# EAGLE schematic cn7macropad (EAGLE 9.6.2)

## Sheet 1 of 3
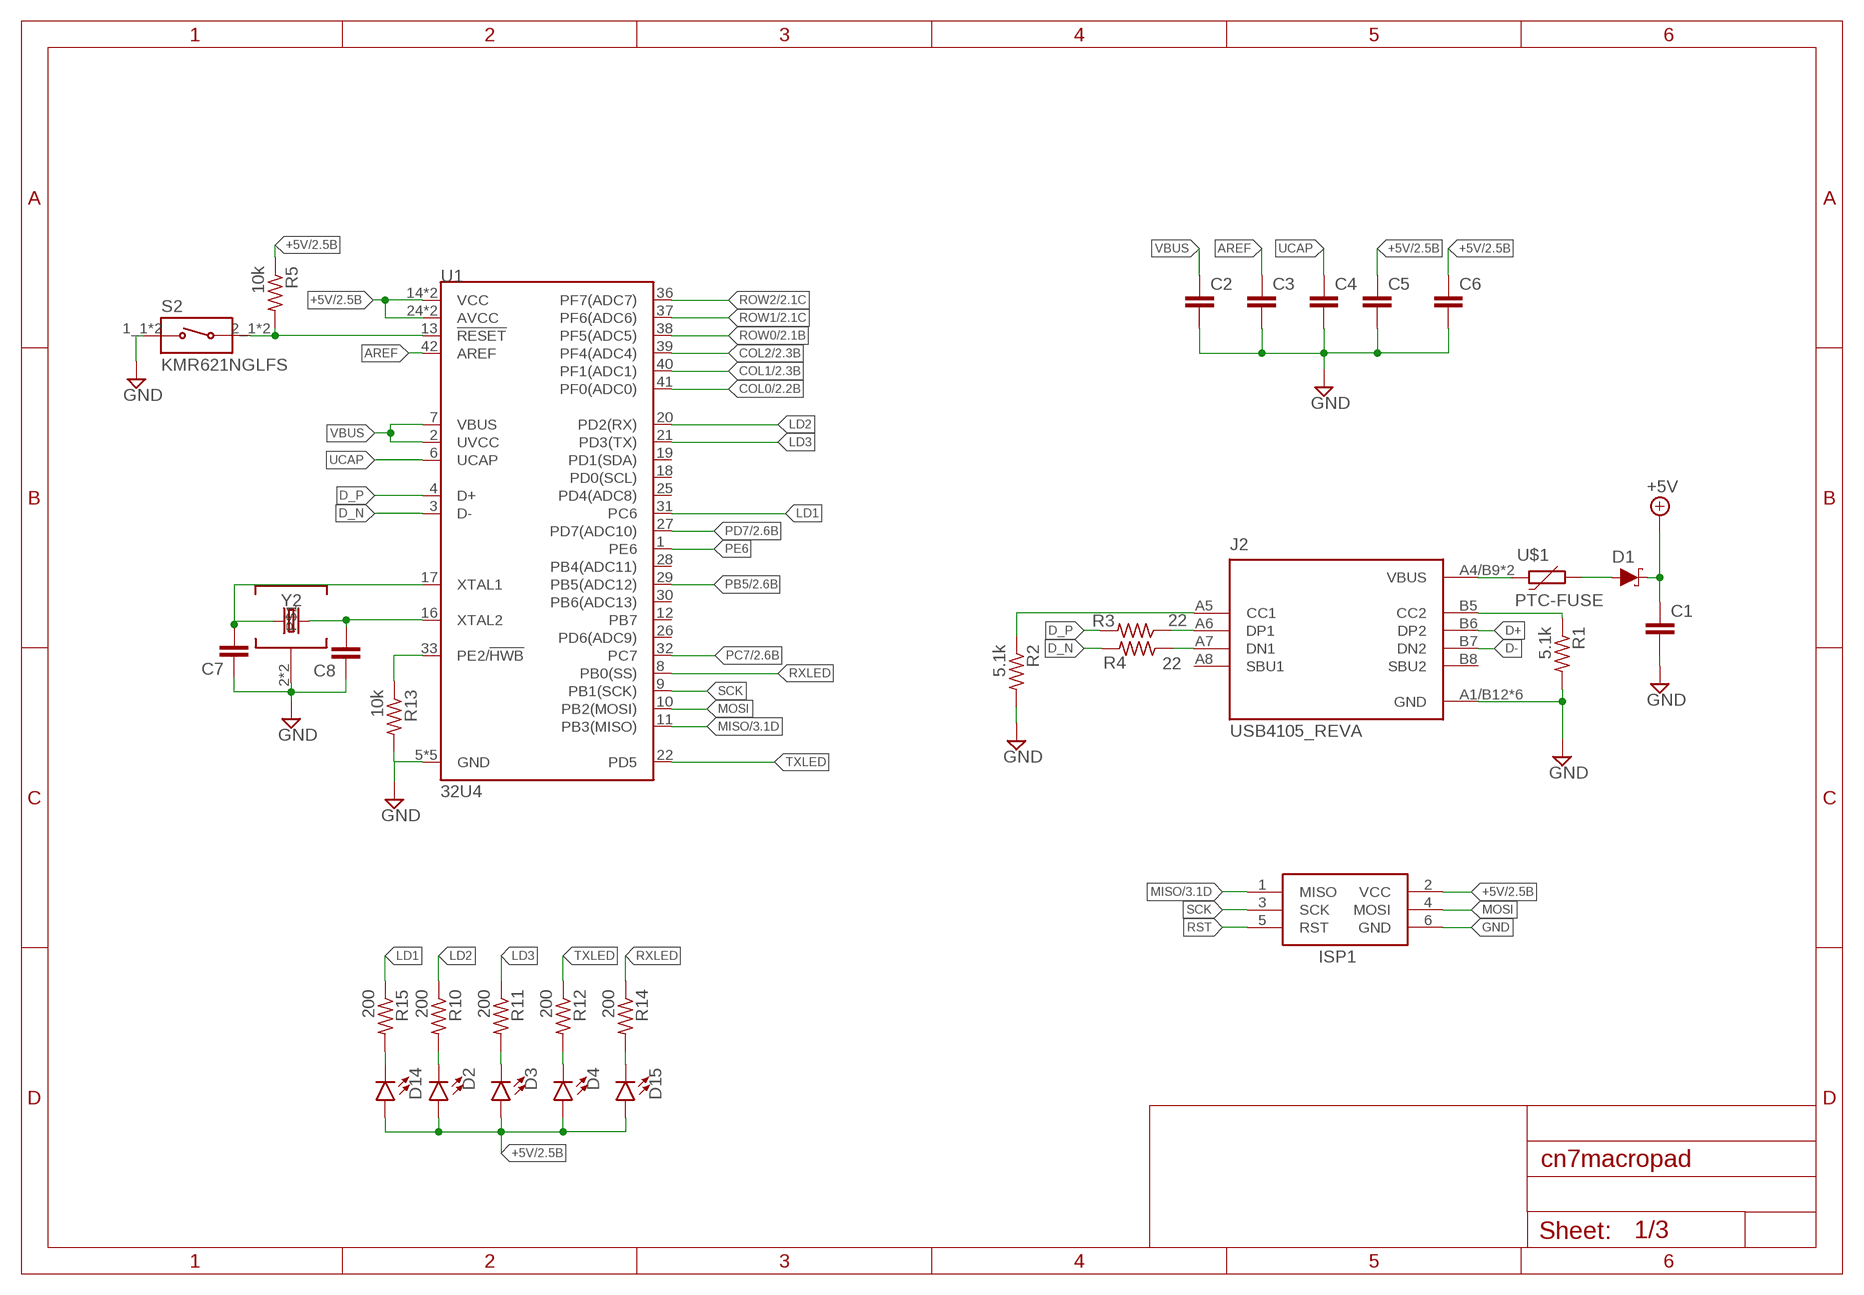
[diagram p0: schematic, sheet 1]

### Parts
C1  10uF  CAP-0603-50V-5%  [0603]
C2  1.0uF  CAP-0603-50V-5%  [0603]
C3  1.0uF  CAP-0603-50V-5%  [0603]
C4  1.0uF  CAP-0603-50V-5%  [0603]
C5  1.0uF  CAP-0603-50V-5%  [0603]
C6  1.0uF  CAP-0603-50V-5%  [0603]
C7  22pF  CAP-0603-50V-5%  [0603]
C8  22pF  CAP-0603-50V-5%  [0603]
D1  3A/10V/280mV  DIODE-SCHOTTKY-BAT60A  [SOD-323]
D2  LED0603  [LED-0603]
D3  LED0603  [LED-0603]
D4  LED0603  [LED-0603]
D14  LED0603  [LED-0603]
D15  LED0603  [LED-0603]
ISP1  AVRISP-6  [AVRISP]
J2  USB4105_REVA  [GCT_USB4105_REVA]
R1  5.1k  RESISTORR0603  [R0603]
R2  5.1k  RESISTORR0603  [R0603]
R3  22  RESISTORR0603  [R0603]
R4  22  RESISTORR0603  [R0603]
R5  10k  RESISTORR0603  [R0603]
R10  200  RESISTORR0603  [R0603]
R11  200  RESISTORR0603  [R0603]
R12  200  RESISTORR0603  [R0603]
R13  10k  RESISTORR0603  [R0603]
R14  200  RESISTORR0603  [R0603]
R15  200  RESISTORR0603  [R0603]
S2  KMR621NGLFS  [SW_KMR621NGLFS]
U1  32U4  ATMEGA32U4TQFP-44  [TQFP44]
U$1  PTC-FUSE  [PTC1206]
Y2  CRYSTALSMD-3.2X2.5  [CRYSTAL-SMD-3.2X2.5MM]

### Nets
+5V: C1.1 C5.1 C6.1 D1.C D2.A D3.A D4.A D14.A D15.A ISP1.2(VCC) R5.1 U1.14(VCC) U1.24(AVCC) U1.34(VCC) U1.44(AVCC) ; also sheet 2,3
AREF: C3.1 U1.42(AREF)
CC1: J2.A5(CC1) R2.1
CC2: J2.B5(CC2) R1.1
COL0: U1.41(PF0(ADC0)) ; also sheet 2
COL1: U1.40(PF1(ADC1)) ; also sheet 2
COL2: U1.39(PF4(ADC4)) ; also sheet 2
D+: J2.A6(DP1) J2.B6(DP2) R3.1
D-: J2.A7(DN1) J2.B7(DN2) R4.1
D_N: R4.2 U1.3(D-)
D_P: R3.2 U1.4(D+)
GND: C1.2 C2.2 C3.2 C4.2 C5.2 C6.2 C7.1 C8.1 ISP1.6(GND) J2.A1/B12(GND) J2.B1/A12(GND) J2.G1(GND) J2.G2(GND) J2.G3(GND) J2.G4(GND) R1.2 R2.2 R13.2 S2.1_1 S2.1_2 U1.5(GND) U1.15(GND) U1.23(GND) U1.35(GND) U1.43(GND) Y2.2 Y2.4 ; also sheet 2,3
LD1: R15.1 U1.31(PC6)
LD2: R10.1 U1.20(PD2(RX))
LD3: R11.1 U1.21(PD3(TX))
MISO: ISP1.1(MISO) U1.11(PB3(MISO)) ; also sheet 3
MOSI: ISP1.4(MOSI) U1.10(PB2(MOSI))
N$1: R13.1 U1.33(PE2/!HWB)
N$3: D15.C R14.2
N$5: D14.C R15.2
N$7: D1.A U$1.2
N$10: C7.2 U1.17(XTAL1) Y2.1
N$11: C8.2 U1.16(XTAL2) Y2.3
N$26: D2.C R10.2
N$27: D3.C R11.2
N$32: D4.C R12.2
PB5: U1.29(PB5(ADC12)) ; also sheet 2
PC7: U1.32(PC7) ; also sheet 2
PD7: U1.27(PD7(ADC10)) ; also sheet 2
PE6: U1.1(PE6)
ROW0: U1.38(PF5(ADC5)) ; also sheet 2
ROW1: U1.37(PF6(ADC6)) ; also sheet 2
ROW2: U1.36(PF7(ADC7)) ; also sheet 2
RST: ISP1.5(RST) R5.2 S2.2_1 S2.2_2 U1.13(!RESET)
RXLED: R14.1 U1.8(PB0(SS))
SCK: ISP1.3(SCK) U1.9(PB1(SCK))
TXLED: R12.1 U1.22(PD5)
UCAP: C4.1 U1.6(UCAP)
VBUS: C2.1 J2.A4/B9(VBUS) J2.B4/A9(VBUS) U1.2(UVCC) U1.7(VBUS) U$1.1
Unconnected: J2.A8(SBU1) J2.B8(SBU2) U1.12(PB7) U1.18(PD0(SCL)) U1.19(PD1(SDA)) U1.25(PD4(ADC8)) U1.26(PD6(ADC9)) U1.28(PB4(ADC11)) U1.30(PB6(ADC13))

## Sheet 2 of 3
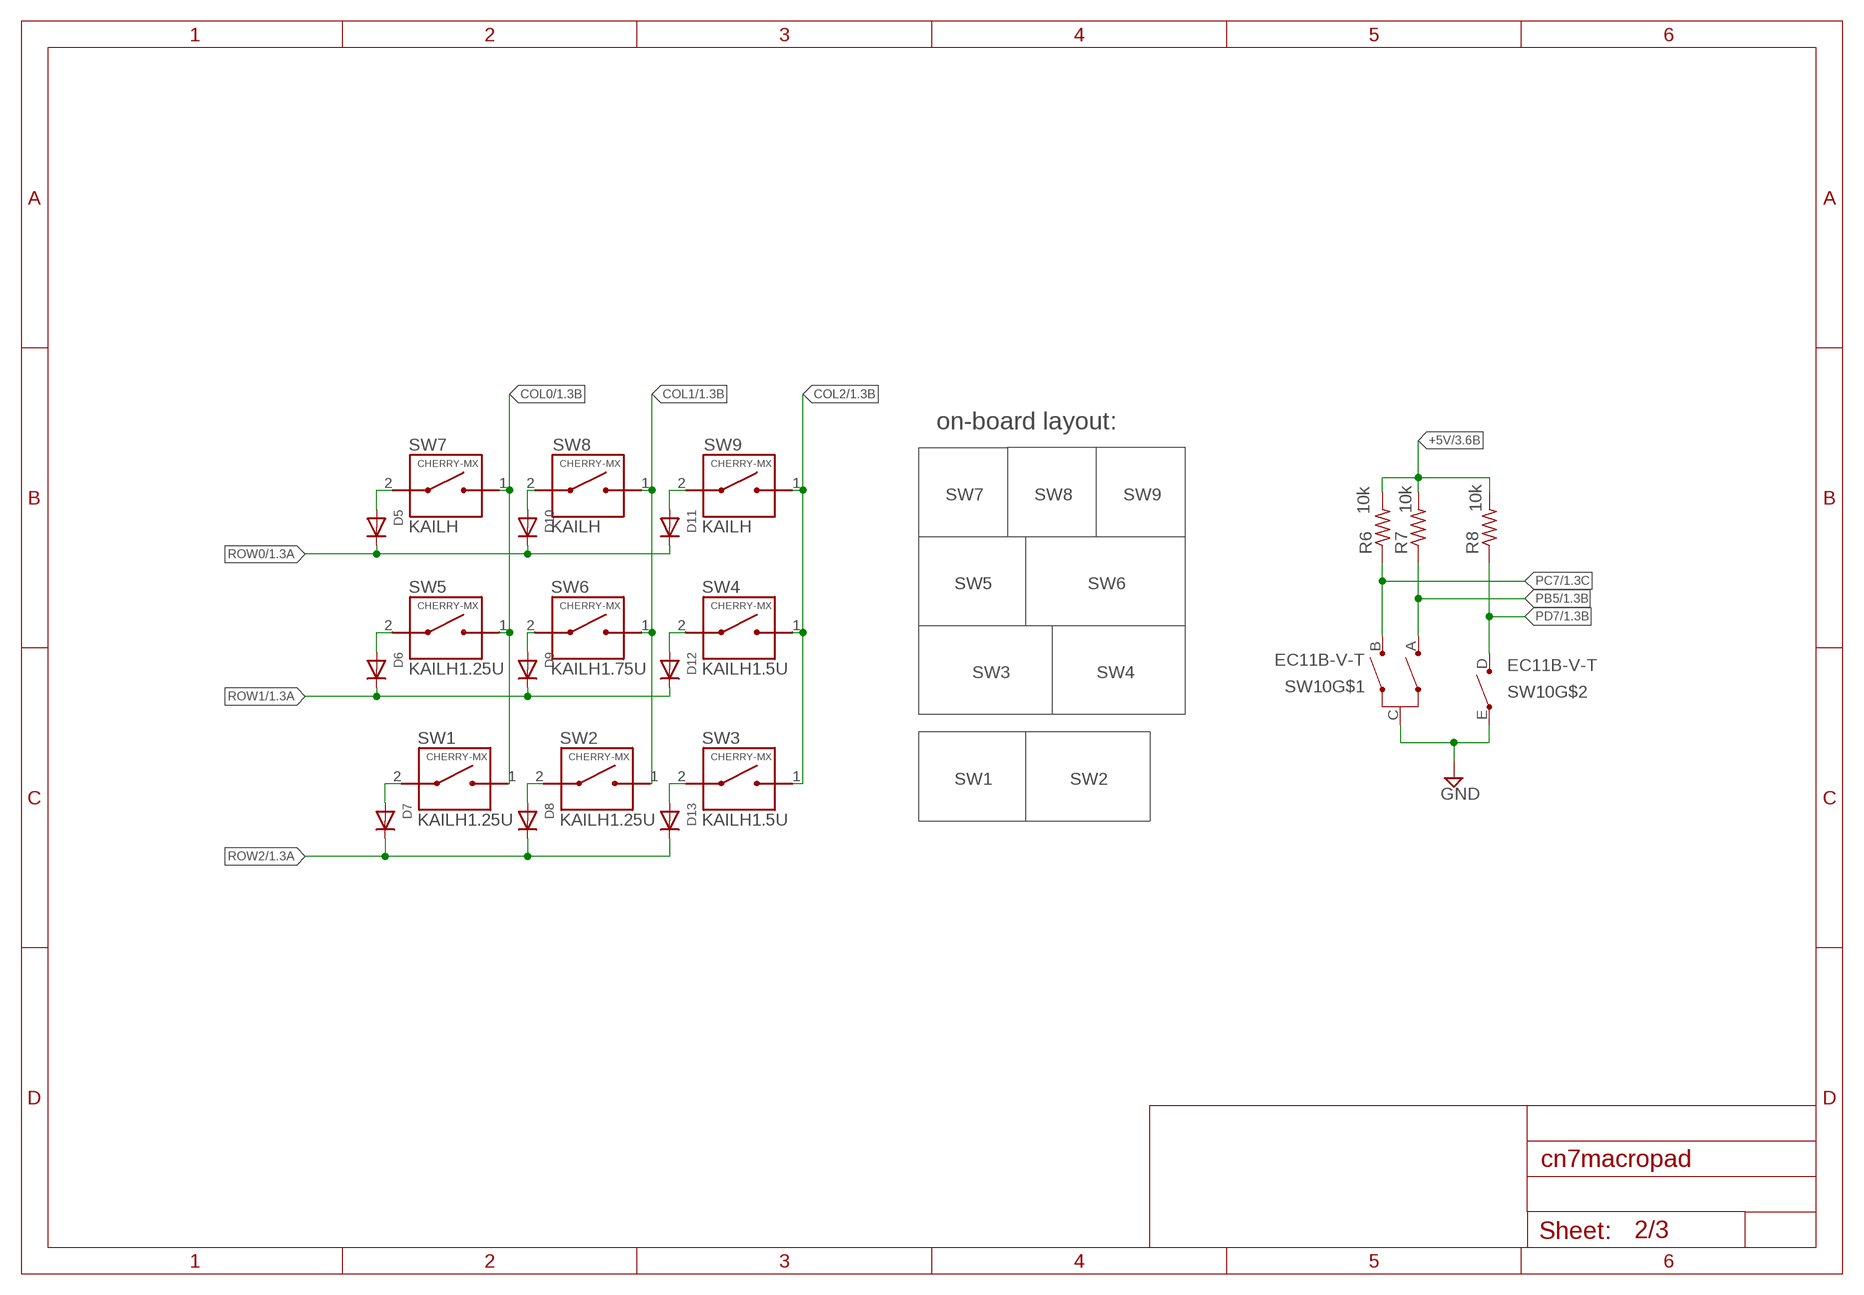
[diagram p1: schematic, sheet 2]

### Parts
D5  DIODE  [SOD-523]
D6  DIODE  [SOD-523]
D7  DIODE  [SOD-523]
D8  DIODE  [SOD-523]
D9  DIODE  [SOD-523]
D10  DIODE  [SOD-523]
D11  DIODE  [SOD-523]
D12  DIODESOD-523  [SOD-523]
D13  DIODESOD-523  [SOD-523]
R6  10k  RESISTORR0603  [R0603]
R7  10k  RESISTORR0603  [R0603]
R8  10k  RESISTORR0603  [R0603]
SW1  KAILH1.25U  [SWITCH_SOCKET-1.25U]
SW2  KAILH1.25U  [SWITCH_SOCKET-1.25U]
SW3  KAILH1.5U  [SWITCH_SOCKET-1.5U]
SW4  KAILH1.5U  [SWITCH_SOCKET-1.5U]
SW5  KAILH1.25U  [SWITCH_SOCKET-1.25U]
SW6  KAILH1.75U  [SWITCH_SOCKET-1.75U]
SW7  KAILH  [SWITCH_SOCKET-1U]
SW8  KAILH  [SWITCH_SOCKET-1U]
SW9  KAILH  [SWITCH_SOCKET-1U]
SW10  EC11B-V-T  [EC11B-V]

### Nets
+5V: R6.2 R7.2 R8.2 ; also sheet 1,3
COL0: SW1.1 SW5.1 SW7.1 ; also sheet 1
COL1: SW2.1 SW6.1 SW8.1 ; also sheet 1
COL2: SW3.1 SW4.1 SW9.1 ; also sheet 1
GND: SW10.C SW10.E ; also sheet 1,3
N$15: D5.A SW7.2
N$16: D6.A SW5.2
N$17: D9.A SW6.2
N$18: D10.A SW8.2
N$19: D7.A SW1.2
N$20: D8.A SW2.2
N$21: D13.A SW3.2
N$22: D12.A SW4.2
N$23: D11.A SW9.2
PB5: R7.1 SW10.A ; also sheet 1
PC7: R6.1 SW10.B ; also sheet 1
PD7: R8.1 SW10.D ; also sheet 1
ROW0: D5.K(C) D10.K(C) D11.K(C) ; also sheet 1
ROW1: D6.K(C) D9.K(C) D12.K(C) ; also sheet 1
ROW2: D7.K(C) D8.K(C) D13.K(C) ; also sheet 1

### Notes on the sheet
- on-board layout:
- SW7 | SW8 | SW9
- SW5 | SW6
- SW3 | SW4
- SW1 | SW2

## Sheet 3 of 3
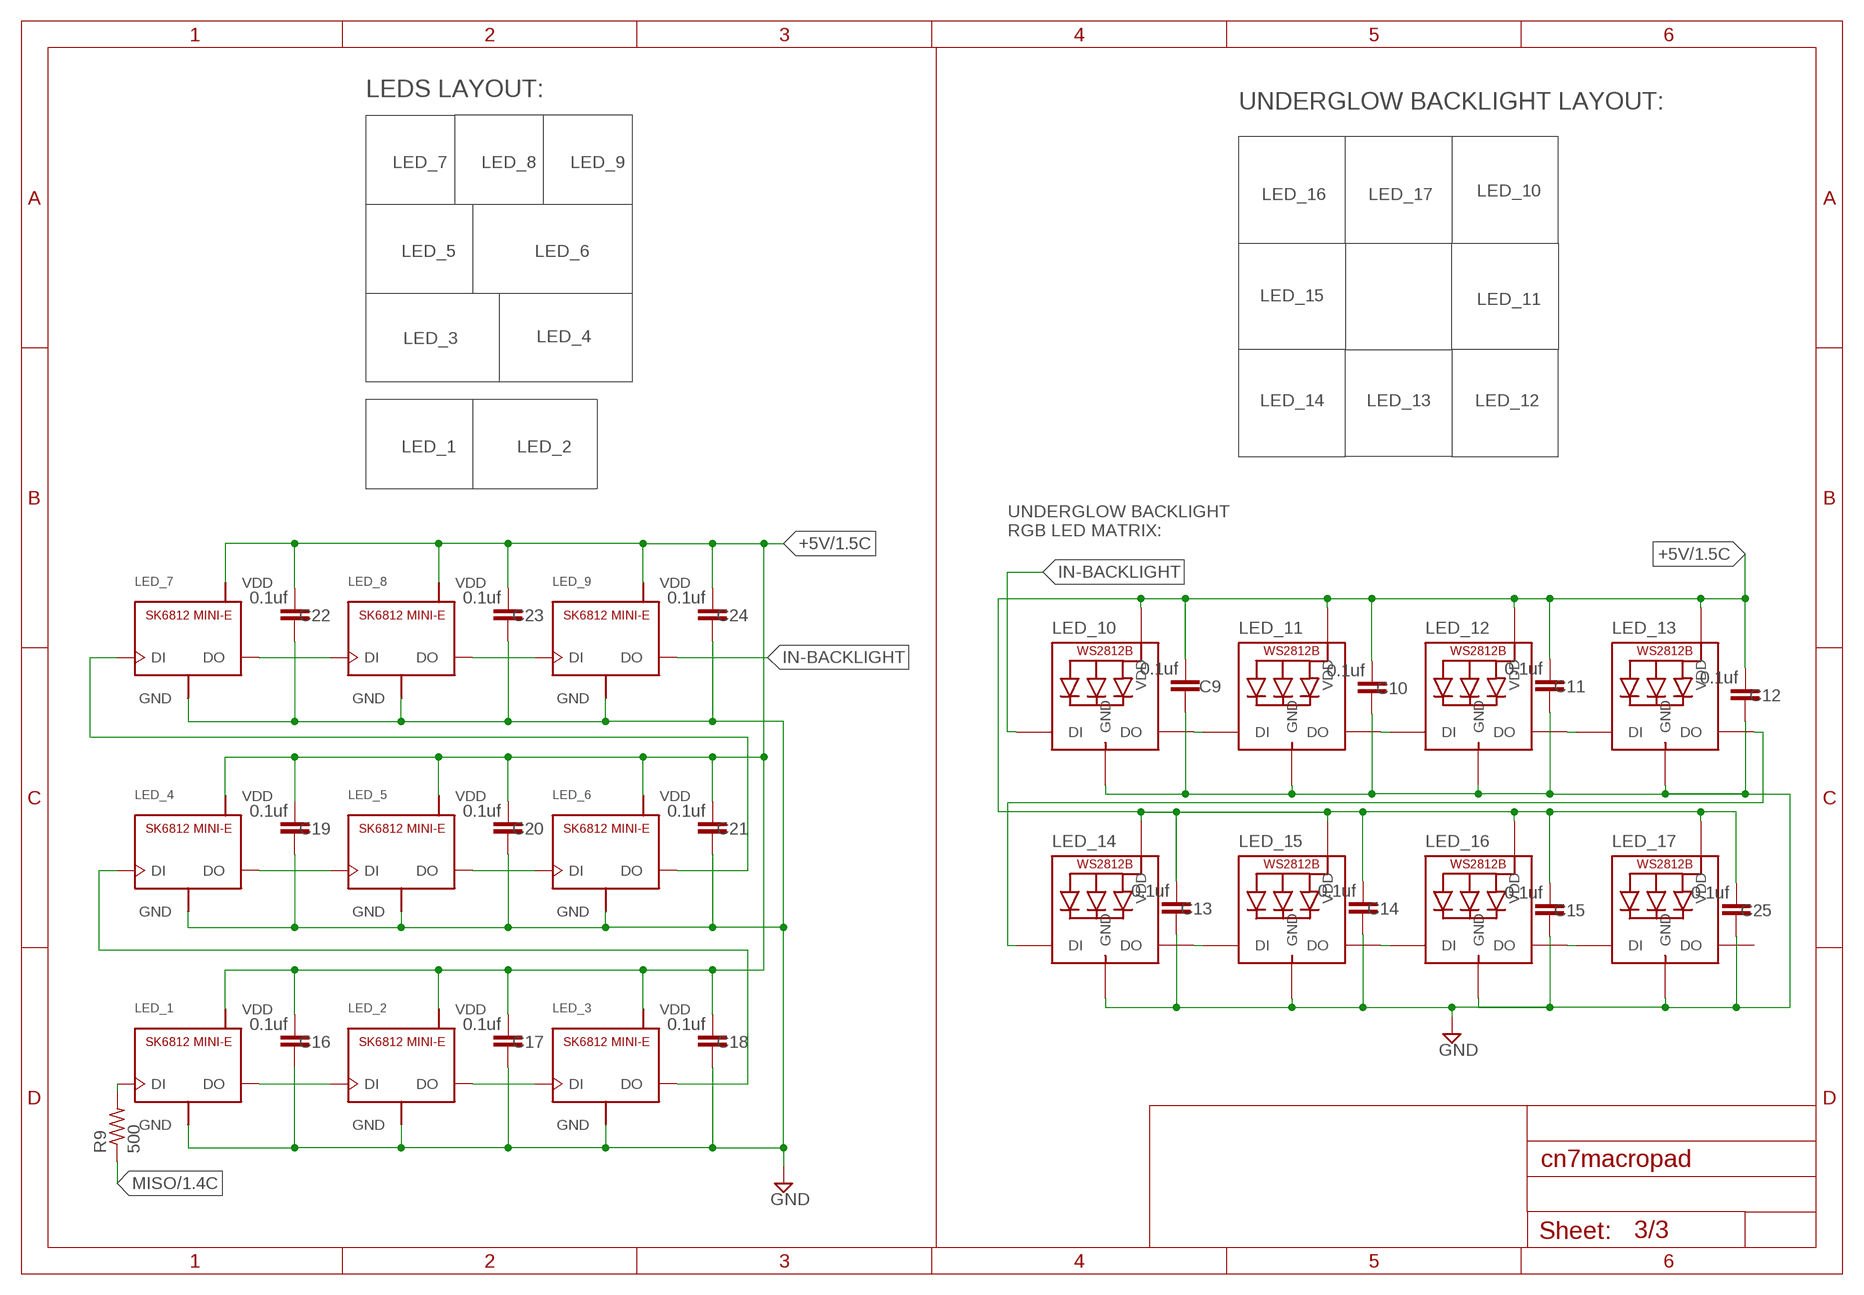
[diagram p2: schematic, sheet 3]

### Parts
C9  0.1uf  CAP-0603-50V-5%  [0603]
C10  0.1uf  CAP-0603-50V-5%  [0603]
C11  0.1uf  CAP-0603-50V-5%  [0603]
C12  0.1uf  CAP-0603-50V-5%  [0603]
C13  0.1uf  CAP-0603-50V-5%  [0603]
C14  0.1uf  CAP-0603-50V-5%  [0603]
C15  0.1uf  CAP-0603-50V-5%  [0603]
C16  0.1uf  CAP-0603-50V-5%  [0603]
C17  0.1uf  CAP-0603-50V-5%  [0603]
C18  0.1uf  CAP-0603-50V-5%  [0603]
C19  0.1uf  CAP-0603-50V-5%  [0603]
C20  0.1uf  CAP-0603-50V-5%  [0603]
C21  0.1uf  CAP-0603-50V-5%  [0603]
C22  0.1uf  CAP-0603-50V-5%  [0603]
C23  0.1uf  CAP-0603-50V-5%  [0603]
C24  0.1uf  CAP-0603-50V-5%  [0603]
C25  0.1uf  CAP-0603-50V-5%  [0603]
LED_1  SK6812-MINI-ESW  [SK6812-MINI-E]
LED_2  SK6812-MINI-ESW  [SK6812-MINI-E]
LED_3  SK6812-MINI-ESW  [SK6812-MINI-E]
LED_4  SK6812-MINI-ESW  [SK6812-MINI-E]
LED_5  SK6812-MINI-ESW  [SK6812-MINI-E]
LED_6  SK6812-MINI-ESW  [SK6812-MINI-E]
LED_7  SK6812-MINI-ESW  [SK6812-MINI-E]
LED_8  SK6812-MINI-ESW  [SK6812-MINI-E]
LED_9  SK6812-MINI-ESW  [SK6812-MINI-E]
LED_10  WS2812B5050  [WS2812B]
LED_11  WS2812B5050  [WS2812B]
LED_12  WS2812B5050  [WS2812B]
LED_13  WS2812B5050  [WS2812B]
LED_14  WS2812B5050  [WS2812B]
LED_15  WS2812B5050  [WS2812B]
LED_16  WS2812B5050  [WS2812B]
LED_17  WS2812B5050  [WS2812B]
R9  500  RESISTORR0603  [R0603]

### Nets
+5V: C9.2 C10.2 C11.2 C12.2 C13.2 C14.2 C15.2 C16.2 C17.2 C18.2 C19.2 C20.2 C21.2 C22.2 C23.2 C24.2 C25.2 LED_1.1-VDD(VDD) LED_2.1-VDD(VDD) LED_3.1-VDD(VDD) LED_4.1-VDD(VDD) LED_5.1-VDD(VDD) LED_6.1-VDD(VDD) LED_7.1-VDD(VDD) LED_8.1-VDD(VDD) LED_9.1-VDD(VDD) LED_10.1-VDD(VDD) LED_11.1-VDD(VDD) LED_12.1-VDD(VDD) LED_13.1-VDD(VDD) LED_14.1-VDD(VDD) LED_15.1-VDD(VDD) LED_16.1-VDD(VDD) LED_17.1-VDD(VDD) ; also sheet 1,2
GND: C9.1 C10.1 C11.1 C12.1 C13.1 C14.1 C15.1 C16.1 C17.1 C18.1 C19.1 C20.1 C21.1 C22.1 C23.1 C24.1 C25.1 LED_1.3-GND(GND) LED_2.3-GND(GND) LED_3.3-GND(GND) LED_4.3-GND(GND) LED_5.3-GND(GND) LED_6.3-GND(GND) LED_7.3-GND(GND) LED_8.3-GND(GND) LED_9.3-GND(GND) LED_10.3-GND(GND) LED_11.3-GND(GND) LED_12.3-GND(GND) LED_13.3-GND(GND) LED_14.3-GND(GND) LED_15.3-GND(GND) LED_16.3-GND(GND) LED_17.3-GND(GND) ; also sheet 1,2
IN-BACKLIGHT: LED_9.2-DOUT(DO) LED_10.4-DIN(DI)
MISO: R9.1 ; also sheet 1
N$2: LED_1.2-DOUT(DO) LED_2.4-DIN(DI)
N$4: LED_2.2-DOUT(DO) LED_3.4-DIN(DI)
N$8: LED_1.4-DIN(DI) R9.2
N$9: LED_3.2-DOUT(DO) LED_4.4-DIN(DI)
N$12: LED_4.2-DOUT(DO) LED_5.4-DIN(DI)
N$13: LED_5.2-DOUT(DO) LED_6.4-DIN(DI)
N$14: LED_6.2-DOUT(DO) LED_7.4-DIN(DI)
N$24: LED_7.2-DOUT(DO) LED_8.4-DIN(DI)
N$25: LED_8.2-DOUT(DO) LED_9.4-DIN(DI)
N$28: LED_10.2-DOUT(DO) LED_11.4-DIN(DI)
N$29: LED_11.2-DOUT(DO) LED_12.4-DIN(DI)
N$30: LED_13.2-DOUT(DO) LED_14.4-DIN(DI)
N$31: LED_14.2-DOUT(DO) LED_15.4-DIN(DI)
N$33: LED_15.2-DOUT(DO) LED_16.4-DIN(DI)
N$34: LED_16.2-DOUT(DO) LED_17.4-DIN(DI)
N$35: LED_12.2-DOUT(DO) LED_13.4-DIN(DI)
Unconnected: LED_17.2-DOUT(DO)

### Notes on the sheet
- LEDS LAYOUT:
- UNDERGLOW BACKLIGHT LAYOUT:
- LED_7 | LED_8 | LED_9
- LED_16 | LED_17 | LED_10
- LED_5 | LED_6
- LED_15 | LED_11
- LED_3 | LED_4
- LED_14 | LED_13 | LED_12
- LED_1 | LED_2
- UNDERGLOW BACKLIGHT
  RGB LED MATRIX:

## Library data of the parts
C1-C25 = kailh_cn7:CAP: 22pF ceramic capacitors A capacitor is a passive two-terminal electrical component used to store electrical energy temporarily in an electric field.; PROD_ID: CAP-07876
D1 = SparkFun-DiscreteSemi:DIODE-SCHOTTKY: Schottky diode A Schottky diode is a semiconductor diode which has a low forward voltage drop and a very fast switching action.; PROD_ID: DIO-14072
D2 = SparkFun-LED:LED: LED (Generic) Standard schematic elements and footprints for 5mm, 3mm, 1206, and 0603 sized LEDs. Generic LEDs with no color specified.
D3 D4 D14 D15 = kailh_cn7:LED: LED (Generic) Standard schematic elements and footprints for 5mm, 3mm, 1206, and 0603 sized LEDs. Generic LEDs with no color specified.
D5-D11 = kailh_cn7:DIODE: Diode SMADIODE - SMA Surface Mount Package 20V 1A Schottky Diode Digikey: 641-1014-6-ND DO-1N4148 - Through Hole Small Current Diode SOD-123 20V 1 A (.5mV Vf) Schottky Diode - Digikey: MBRX120TPMSCT-ND SOD-323 10V 570mA (.38mV Vf, 3ns) Schottky Diode - Digikey: ZLLS410CT-ND SOD-523 30V 30mA Schottky Diode (RB751S-40TE61) - Digikey: RB751S-40TE61CT-ND SOT23-R/W - SOT23 Package (R = Solder Paste/Reflow Ovens, W = Hand-Soldering) BAT54Film 40V 300mA - Digikey: 497-7162-1-ND
D12 D13 = adafruit:DIODE: Diode SMADIODE - SMA Surface Mount Package 20V 1A Schottky Diode Digikey: 641-1014-6-ND DO-1N4148 - Through Hole Small Current Diode SOD-123 20V 1 A (.5mV Vf) Schottky Diode - Digikey: MBRX120TPMSCT-ND SOD-323 10V 570mA (.38mV Vf, 3ns) Schottky Diode - Digikey: ZLLS410CT-ND SOD-523 30V 30mA Schottky Diode (RB751S-40TE61) - Digikey: RB751S-40TE61CT-ND SOT23-R/W - SOT23 Package (R = Solder Paste/Reflow Ovens, W = Hand-Soldering) BAT54Film 40V 300mA - Digikey: 497-7162-1-ND
ISP1 = adafruit:AVRISP: AVR ISP HEADER Standard 6 pin header for AVR programming
J2 = USB4105_REVA:USB4105_REVA: USB Type C Receptacle for USB 2.0 SMT Type, PCB Top Mount; DESCRIPTION: USB-C (USB TYPE-C) USB 2.0 Receptacle Connector 24 (16+8 Dummy) Position Surface Mount, Right Angle; Through Hole; DIGI-KEY_PART_NUMBER: 2073-USB4105-GF-ACT-ND; MF: Global Connector Technology; MP: USB4105; PACKAGE: Package; PURCHASE-URL: https://pricing.snapeda.com/search/part/USB4105/?ref=eda
LED_1-LED_9 = kailh_cn7:SK6812-MINI-E
LED_10 = kailh_cn7:WS2812B; SPICEPREFIX: E
LED_11-LED_17 = kailh_cn7:WS2812B
R1-R15 = kailh_cn7:RESISTOR: RESISTOR, American symbol
S2 = KMR621NGLFS:KMR621NGLFS: Tactile Switches 50mA 32VDC 1.9mmH 2N IP67; DESCRIPTION: Tactile Switch SPST-NO Top Actuated Surface Mount; DIGI-KEY_PART_NUMBER: CKN10684CT-ND; MF: C&K; MP: KMR621NG LFS; PACKAGE: None; PURCHASE-URL: https://pricing.snapeda.com/search/part/KMR621NG LFS/?ref=eda
SW1-SW9 = kailh_cn7:KAILH
SW10 = kailh_cn7:EC11B-V-T: ALPS EC11B Vertikal mit Taster Drehimpulsgeber 11mm
U1 = SparkFun-IC-Microcontroller:ATMEGA32U4: Atmel MCU, 32KByte Atmel 44-pin 8-bit Microcontroller with 32KBytes of ISP Flash and USB Controller Datasheet <http://cdn.sparkfun.com/datasheets/Dev/Arduino/Boards/ATMega32U4.pdf> SparkFun Products LilyPad Arduino USB - ATmega32U4 Board <https://www.sparkfun.com/products/12049> (DEV-12049) Pro Micro - 5V/16MHz <https://www.sparkfun.com/products/12640> (DEV-12640) Pro Micro - 3.3V/8MHz <https://www.sparkfun.com/products/12587> (DEV-12587) Fio v3 - ATmega32U4 <https://www.sparkfun.com/products/11520> (DEV-11520) Qduino Mini <https://www.sparkfun.com/products/13614> (DEV-13614) Makey Makey - Standard Kit <https://www.sparkfun.com/products/11511> (WIG-11511) Makey Makey Deluxe Kit <https://www.sparkfun.com/products/11519> (WIG-11519); PROD_ID: IC-11161
U$1 = kailh_cn7:PTC-FUSE
Y2 = kailh_cn7:CRYSTAL: Crystals (Generic) These are passive quartz crystals, which can be used as a clock source for a microcontroller. Crystal's are two-terminal devices. They require external "load" capacitors to generate an oscillating signal.